# Altium schematic sheet EtherWiz_Mini.SchDoc
size A3; SheetNumber: 3; SheetTotal: 4
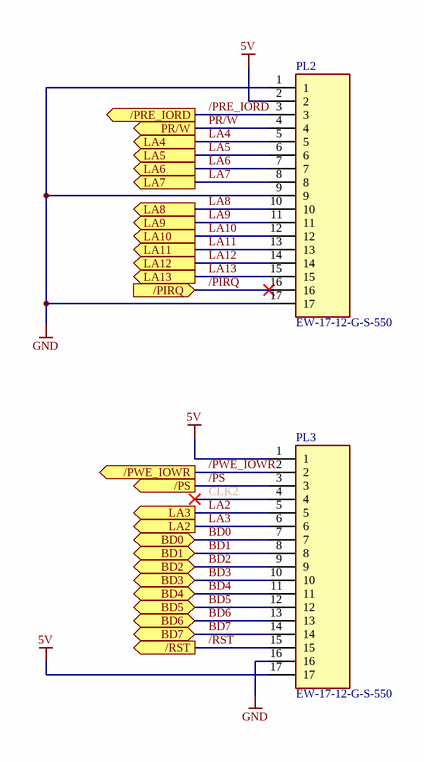
[diagram p0: EtherWiz_Mini.SchDoc]

## Parts
PL2  EW-17-12-G-S-550  [TSW-117-XX-YY-S]
PL3  EW-17-12-G-S-550  [TSW-117-XX-YY-S]

## Ports
/PIRQ (in, see EtherWiz[3D], EtherWiz_FullSize[5B]), /PRE_IORD (out, see EtherWiz[6A], EtherWiz_FullSize[5B]), /PS (out, see EtherWiz[6A], EtherWiz_FullSize[5B]), /PWE_IOWR (out, see EtherWiz[6A], EtherWiz_FullSize[5B]), /RST (out, see EtherWiz[2B], EtherWiz_FullSize[5B]), BD0 (bidir, see EtherWiz[5B], EtherWiz_FullSize[4C]), BD1 (bidir, see EtherWiz[5A], EtherWiz_FullSize[4C]), BD2 (bidir, see EtherWiz[5A], EtherWiz_FullSize[4C]), BD3 (bidir, see EtherWiz[5A], EtherWiz_FullSize[4C]), BD4 (bidir, see EtherWiz[5A], EtherWiz_FullSize[4C]), BD5 (bidir, see EtherWiz[5A], EtherWiz_FullSize[4C]), BD6 (bidir, see EtherWiz[5A], EtherWiz_FullSize[4C]), BD7 (bidir, see EtherWiz[5A], EtherWiz_FullSize[4C]), LA2 (out, see EtherWiz[6A], EtherWiz_FullSize[4B]), LA3 (out, see EtherWiz[6A], EtherWiz_FullSize[4B]), LA4 (out, see EtherWiz[2B], EtherWiz_FullSize[4B]), LA5 (out, see EtherWiz[2B], EtherWiz_FullSize[4B]), LA6 (out, see EtherWiz[1B], EtherWiz_FullSize[4B]), LA7 (out, see EtherWiz[1B], EtherWiz_FullSize[4B]), LA8 (out, see EtherWiz[1B], EtherWiz_FullSize[4B]), LA9 (out, see EtherWiz[1B], EtherWiz_FullSize[4B]), LA10 (out, see EtherWiz[1A], EtherWiz_FullSize[4B]), LA11 (out, see EtherWiz[1A], EtherWiz_FullSize[4B]), LA12 (out, see EtherWiz[6A], EtherWiz_FullSize[4B]), LA13 (out, see EtherWiz[6A], EtherWiz_FullSize[4B]), PR/W (out, see EtherWiz[6A], EtherWiz_FullSize[5B])

## Nets
5V: PL2.2 PL3.1 PL3.17
GND: PL2.1 PL2.9 PL2.17 PL3.16
/PIRQ: PL2.16 ; port /PIRQ
/PRE_IORD: PL2.3 ; port /PRE_IORD
/PS: PL3.3 ; port /PS
/PWE_IOWR: PL3.2 ; port /PWE_IOWR
/RST: PL3.15 ; port /RST
BD0: PL3.7 ; port BD0
BD1: PL3.8 ; port BD1
BD2: PL3.9 ; port BD2
BD3: PL3.10 ; port BD3
BD4: PL3.11 ; port BD4
BD5: PL3.12 ; port BD5
BD6: PL3.13 ; port BD6
BD7: PL3.14 ; port BD7
CLK2: PL3.4
LA2: PL3.5 ; port LA3
LA3: PL3.6 ; port LA2
LA4: PL2.5 ; port LA4
LA5: PL2.6 ; port LA5
LA6: PL2.7 ; port LA6
LA7: PL2.8 ; port LA7
LA8: PL2.10 ; port LA8
LA9: PL2.11 ; port LA9
LA10: PL2.12 ; port LA10
LA11: PL2.13 ; port LA11
LA12: PL2.14 ; port LA12
LA13: PL2.15 ; port LA13
PR/W: PL2.4 ; port PR/W

## Notes on the sheet
- SIZE
- DIMENSIONS
- TITLE
- VARIANT
- REVISION
- DATE
- A3
- SHEET
- OF
- FILE
- DRAWN BY

## Library data of the parts
PL2 PL3 = TSW-117-05-G-S: Connector; Manufacturer_Name: SAMTEC; Datasheet Link: http://suddendocs.samtec.com/prints/tsw-xxx-xx-xxx-x-xx-xxx-mkt.pdf; Manufacturer_Part_Number: TSW-117-05-G-S